# EAGLE design T-Board-44-84 Etch - v0.1 (EAGLE 6.5.0)
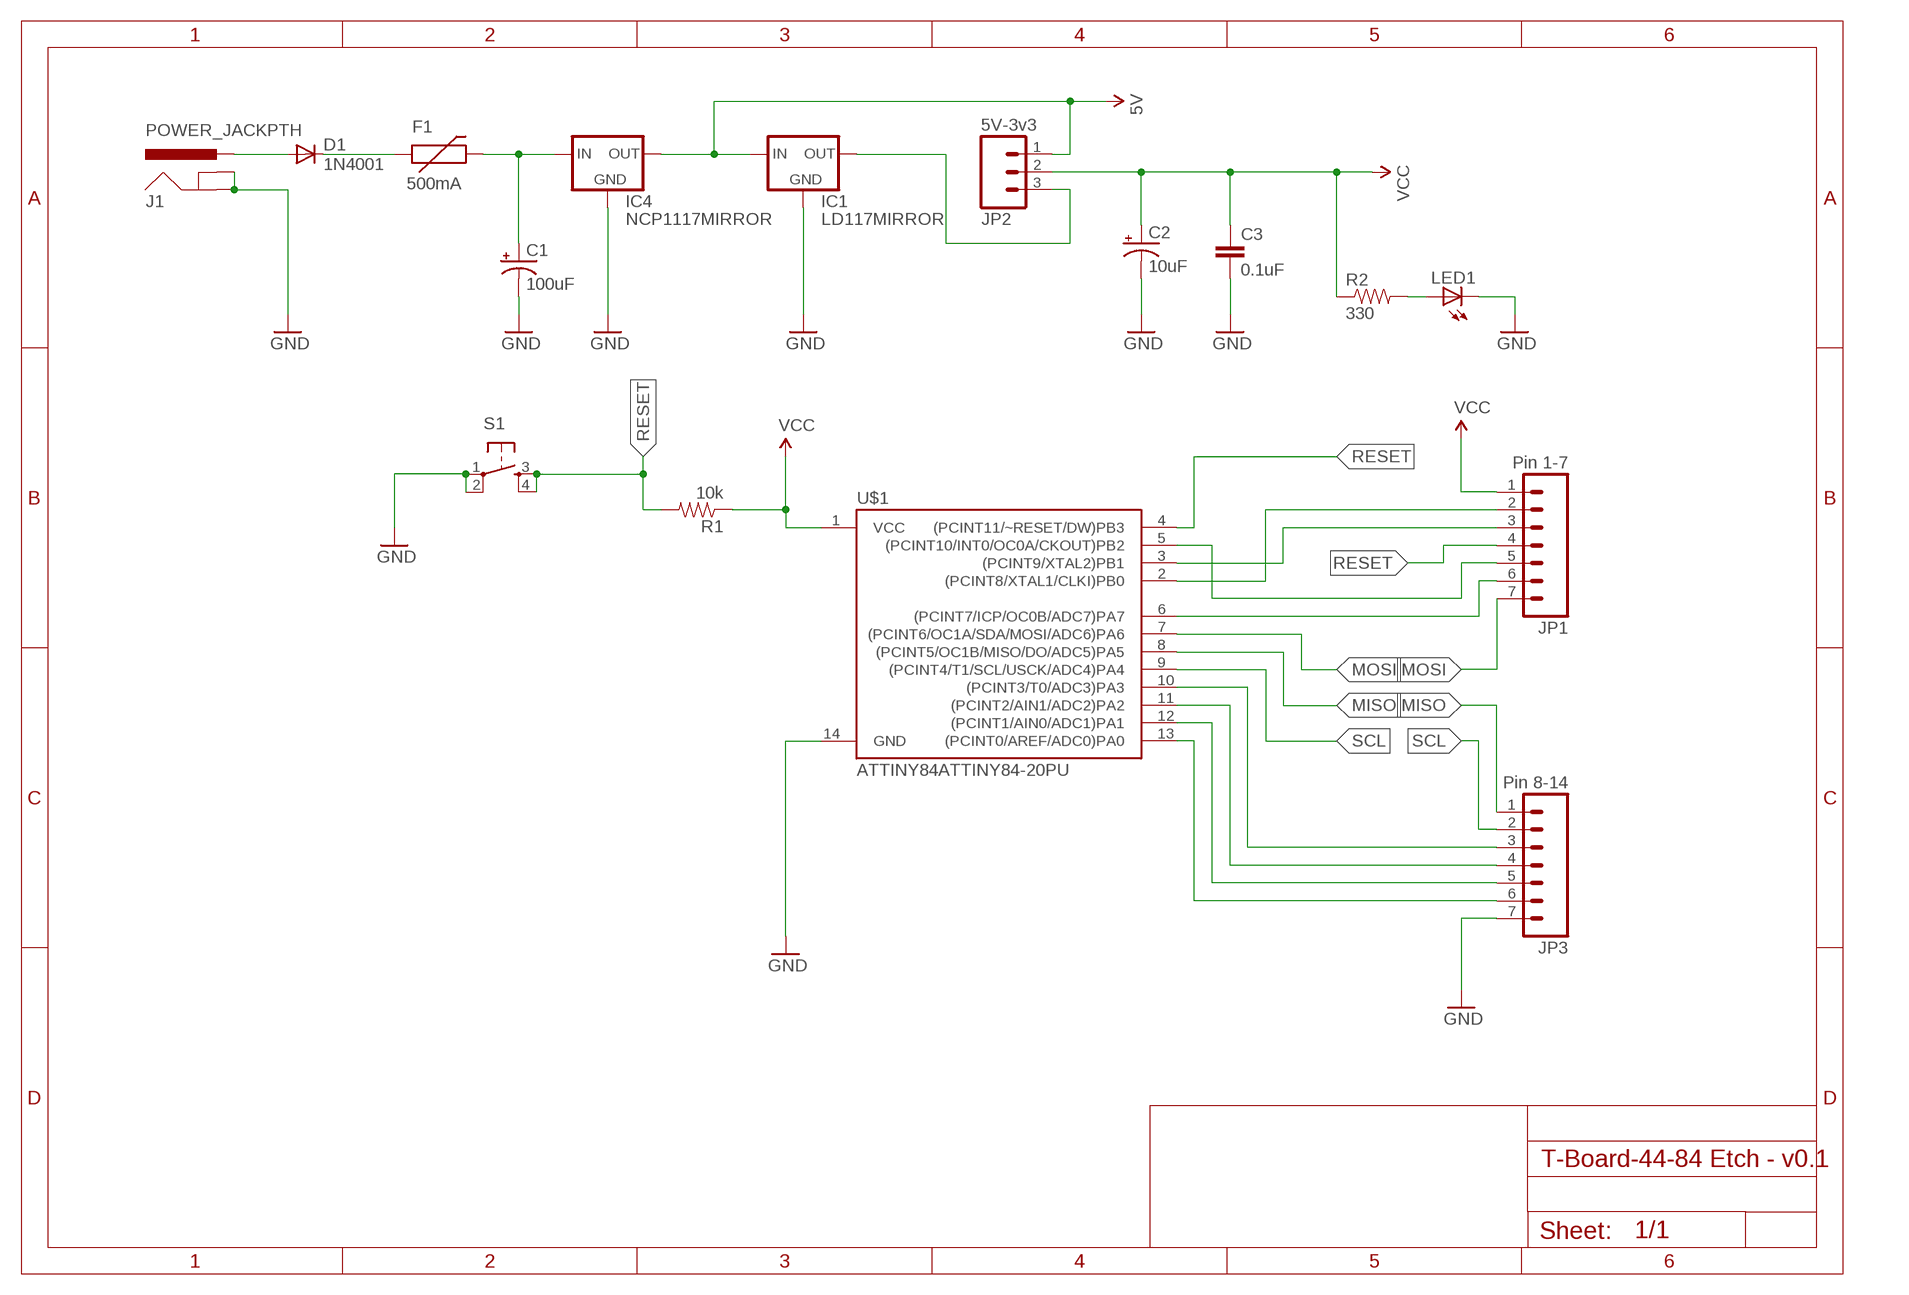
[diagram p0: schematic, sheet 1]

## Parts
C1  100uF  CAP_POLPTH1  [CPOL-RADIAL-100UF-25V]
C2  10uF  CAP_POLPTH2  [CPOL-RADIAL-10UF-25V]
C3  0.1uF  CAP1206  [1206]
D1  1N4001  DIODEPTH  [DIODE-1N4001]
F1  500mA  PTCPTH  [PTC]
IC1  LD117MIRROR  [SOT223]
IC4  NCP1117MIRROR  [DPACK]
J1  POWER_JACKPTH  [POWER_JACK_PTH]
JP1  Pin 1-7  M07  [1X07]
JP2  5V-3v3  M03PTH  [1X03]
JP3  Pin 8-14  M07  [1X07]
LED1  LED1206  [LED-1206]
R1  10k  RESISTOR1206  [1206]
R2  330  RESISTOR1206  [1206]
S1  TAC_SWITCHPTH  [TACTILE-PTH]
U$1  ATTINY84ATTINY84-20PU  [DIL14]

## Nets
5V: IC1.1(IN) IC4.4(OUT) JP2.1
GND: C1.2(-) C2.2(-) C3.2 IC1.3(GND) IC4.3(GND) J1.GND J1.GNDBREAK JP3.7 LED1.C S1.1 S1.2 U$1.14(GND)
MISO: JP3.1 U$1.8((PCINT5/OC1B/MISO/DO/ADC5)PA5)
MOSI: JP1.7 U$1.7((PCINT6/OC1A/SDA/MOSI/ADC6)PA6)
N$1: D1.A J1.PWR
N$2: JP1.2 U$1.2((PCINT8/XTAL1/CLKI)PB0)
N$3: D1.C F1.P$1
N$4: C1.1(+) F1.P$2 IC4.1(IN)
N$5: JP1.3 U$1.3((PCINT9/XTAL2)PB1)
N$6: JP3.3 U$1.10((PCINT3/T0/ADC3)PA3)
N$7: JP1.6 U$1.6((PCINT7/ICP/OC0B/ADC7)PA7)
N$8: JP3.4 U$1.11((PCINT2/AIN1/ADC2)PA2)
N$9: LED1.A R2.2
N$10: IC1.4(OUT) JP2.3
N$11: JP3.5 U$1.12((PCINT1/AIN0/ADC1)PA1)
N$12: JP3.6 U$1.13((PCINT0/AREF/ADC0)PA0)
N$14: JP1.5 U$1.5((PCINT10/INT0/OC0A/CKOUT)PB2)
RESET: JP1.4 R1.2 S1.3 S1.4 U$1.4((PCINT11/~RESET/DW)PB3)
SCL: JP3.2 U$1.9((PCINT4/T1/SCL/USCK/ADC4)PA4)
VCC: C2.1(+) C3.1 JP1.1 JP2.2 R1.1 R2.1 U$1.1(VCC)

## Library data of the parts
C1 C2 = SparkFun-Capacitors:CAP_POL: Capacitor Polarized These are standard SMD and PTH capacitors. Normally 10uF, 47uF, and 100uF in electrolytic and tantalum varieties. Always verify the external diameter of the through hole cap, it varies with capacity, voltage, and manufacturer. The EIA devices should be standard.
C3 = SparkFun-Passives:CAP: Capacitor Standard 0603 ceramic capacitor, and 0.1" leaded capacitor.
D1 = SparkFun-DiscreteSemi:DIODE: Diode These are standard reverse protection diodes and small signal diodes. SMA package can handle up to about 1A. SOD-323 can handle about 200mA. What the SOD-323 package when ordering, there are some mfgs out there that are 5-pin packages.
F1 = SparkFun-PowerIC:PTC: Resettable Fuse PTC Resettable Fuse. Spark Fun Electronics SKU : COM-08357
IC1 = AndyTallack:LD117: Low drop fixed and adjustable positive voltage regulators 1 A Source: http://www.st.com/stonline/products/literature/ds/7194/ld1117axx.pdf
IC4 = AndyTallack:NCP1117: NCP1117 ON Semiconductor low dropout fixed voltage regulator
J1 = SparkFun-Connectors:POWER_JACK: Power Jack This is the standard 5.5mm barrel jack for power. The PTH is the most common, proven, reliable, footprint. The Slot footprint only works if the mill layer is transmitted to the PCB fab house so be warned. Mating wall wart : TOL-00298 (and others); PROD_ID: PRT-00119
JP1 JP3 = SparkFun-Connectors:M07: Header 7 Standard 7-pin 0.1" header. Use with straight break away headers (SKU : PRT-00116), right angle break away headers (PRT-00553), swiss pins (PRT-00743), machine pins (PRT-00117), and female headers (PRT-00115). NOTES ON THE VARIANTS LOCK and LOCK_LONGPADS... This footprint was designed to help hold the alignment of a through-hole component (i.e. 7-pin header) while soldering it into place. You may notice that each hole has been shifted either up or down by 0.005 of an inch from it's more standard position (which is usually a perfectly straight line). This slight alteration caused the pins (the squares in the middle) to touch the edges of the holes. Because they are alternating, it causes a "brace" to hold the header in place. 0.005 has proven to be the perfect amount of "off-center" position when using our standard breakaway headers. Although looks a little odd when you look at the bare footprint, once you have a header in there, the alteration is very hard to notice. Also, if you push a header all the way into place, it is covered up entirely on the bottom side. This idea of altering the position of holes to aid alignment will be further integrated into the Sparkfun Library for other footprints. It can help hold any component with 3 or more connection pins.
JP2 = SparkFun-Connectors:M03: Header 3 Standard 3-pin 0.1" header. Use with straight break away headers (SKU : PRT-00116), right angle break away headers (PRT-00553), swiss pins (PRT-00743), machine pins (PRT-00117), and female headers (PRT-00115). Molex polarized connector foot print use with SKU : PRT-08232 with associated crimp pins and housings.
LED1 = SparkFun-LED:LED: LEDs Standard schematic elements and footprints for 5mm, 3mm, 1206, and 0603 sized LEDs. 5mm - Spark Fun Electronics SKU : COM-00529 (and others)
R1 R2 = SparkFun-Passives:RESISTOR: Resistor Basic schematic elements and footprints for 0603, 1206, and PTH resistors.
S1 = SparkFun-Electromechanical:TAC_SWITCH: Momentary Switch Button commonly used for reset or general input. Spark Fun Electronics SKU : COM-00097 SMT- SWCH-08247
U$1 = SparkFun-DigitalIC:ATTINY84: Atmel 14-pin 2/4/8kB flash uC

## Net classes
0 default: width 0.254 mm, drill 0.33 mm, clearance 0.254 mm

## Board
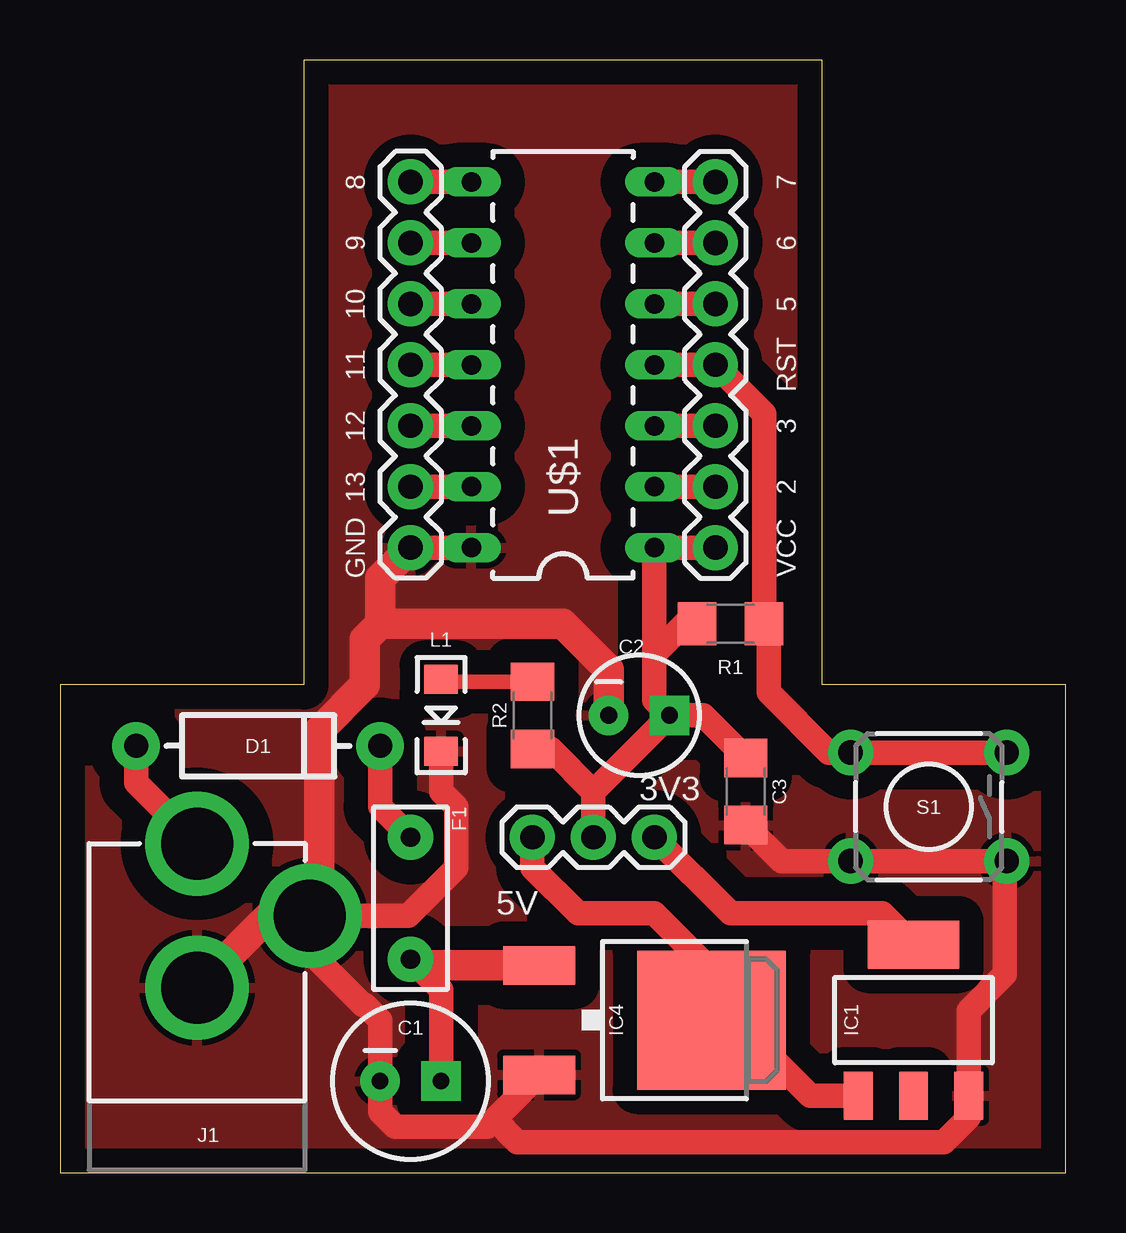
[diagram p1: board, top side]

Size 41.91 x 46.35 mm. Coordinates in mm from the lower left corner, seen from the top.
Outline: 0,0 41.91,0 41.91,20.32 31.75,20.32 31.75,46.35 10.16,46.35 10.16,20.32 0,20.32 0,0
Copper layers (1*16): Top 0.0356mm / dielectric 1.5011mm / Bottom 0.0356mm
Design rules "LaenPCBOrder": minimum track width 6mil, minimum drill 13mil, track to track 6mil, track to pad 6mil, pad to pad 6mil, via to via 6mil, smd to smd 6mil, copper to edge 15mil, drill to drill 6mil, minimum pad ring 7mil, minimum via ring 7mil, stop-mask expansion 3mil, vias tented up to drill 0mil, thermal gap 10mil

### Footprints (pad centres in the part's own frame; a part is rotated, then mirrored left to right if it is on the bottom)
CPOL-RADIAL-100UF-25V = drill 0.7 pad 1.651 square: 1 1.27,0 | drill 0.7 pad 1.651: 2 -1.27,0
CPOL-RADIAL-10UF-25V = drill 0.7 pad 1.651 square: 1 1.27,0 | drill 0.7 pad 1.651: 2 -1.27,0
1206 = smd 1.6 x 1.8: 1 -1.4,0; 2 1.4,0
DIODE-1N4001 = drill 1 pad 1.981: A -5.08,0; C 5.08,0
PTC = drill 0.8 pad 1.88: P$1 -2.54,0; P$2 2.54,0
SOT223 = smd 1.2 x 2: 1 -2.3,-3.15; 2 0,-3.15; 3 2.3,-3.15 | smd 3.8 x 2: 4 0,3.15
DPACK = smd 1.6 x 3: 1 -2.28,-4.8; 3 2.28,-4.8 | smd 5.8 x 6.2: 4 0,2.38
POWER_JACK_PTH = drill 2.997 pad 4.318: GND 0,7.7; GNDBREAK 4.7,10.7; PWR 0,13.7
1X07 = drill 1.016 pad 1.88: 1 0,0; 2 2.54,0; 3 5.08,0; 4 7.62,0; 5 10.16,0; 6 12.7,0; 7 15.24,0
1X03 = drill 1.016 pad 1.88: 1 0,0; 2 2.54,0; 3 5.08,0
LED-1206 = smd 1.2 x 1.4: A -1.5,0; C 1.5,0
TACTILE-PTH = drill 1.016 pad 1.88: 1 -3.251,2.261; 2 3.251,2.261; 3 -3.251,-2.261; 4 3.251,-2.261
DIL14 = drill 0.813 long: 1 -8.89,-3.81; 2 -6.35,-3.81; 3 -3.81,-3.81; 4 -1.27,-3.81; 5 1.27,-3.81; 6 3.81,-3.81; 7 6.35,-3.81; 8 6.35,3.81; 9 3.81,3.81; 10 1.27,3.81; 11 -1.27,3.81; 12 -3.81,3.81; 13 -6.35,3.81; 14 -8.89,3.81

### Placement (x,y rotation side)
C1  14.61,3.81 0 top
C2  24.13,19.05 0 top
C3  28.57,15.88 270 top
D1  8.26,17.78 0 top
F1  14.61,11.43 270 top
IC1  35.56,6.35 0 top
IC4  24.77,6.35 270 top
J1  5.71,0 0 top
JP1  27.3,26.04 90 top
JP2  19.68,13.97 0 top
JP3  14.61,41.27 270 top
LED1  15.88,19.05 270 top
R1  27.94,22.86 0 top
R2  19.68,19.05 90 top
S1  36.2,15.24 180 top
U$1  20.95,34.92 90 top

### Tracks (layer width: path | path; a pad name or v marks a point on that pad's centre or on a via)
5V
  Top 1.016: IC4.4 27.94,6.51 | JP2.1 19.68,12.7 21.59,10.79 24.77,10.79 27.94,7.62 27.94,6.51 | 27.94,6.51 31.25,3.2 IC1.1
GND
  Top 1.016: 18.11,2.21 17.8,1.91 13.97,1.91 13.34,2.54 C1.2 13.34,6.35 12.7,6.99 12.61,6.99 8.89,10.7 | 18.11,2.21 IC4.3 | J1.GNDBREAK 14.51,10.7 16.51,12.7 16.51,15.24 15.88,15.88 LED1.C | C3.2 30.07,12.98 S1.2 S1.1 39.37,12.9 39.37,8.26 37.86,6.75 IC1.3 37.86,2.3 36.83,1.27 19.05,1.27 18.11,2.21 | JP3.7 U$1.14
  Top 1.27: J1.GND 8.71,10.7 8.89,10.7 | 8.89,10.7 J1.GNDBREAK | C2.2 22.86,20.95 20.95,22.86 13.34,22.86 | 13.34,22.86 12.7,22.23 12.7,20.32 10.79,18.41 10.79,12.61 8.89,10.7 | 13.34,22.86 13.34,24.77 JP3.7
  pour Top (isolate 1.016): 10.16,46.35 10.16,20.32 0,20.32 0,0 41.91,0 41.91,20.32 31.75,20.32 31.75,46.35
MISO
  Top 1.016: JP3.1 U$1.8
MOSI
  Top 1.016: JP1.7 U$1.7
N$1
  Top 1.016: J1.PWR 3.17,16.24 D1.A
N$2
  Top 1.016: JP1.2 U$1.2
N$3
  Top 1.016: D1.C 13.34,15.24 F1.P$1
N$4
  Top 1.016: C1.1 15.88,7.62 F1.P$2 14.87,8.63
  Top 1.27: 14.87,8.63 IC4.1
N$5
  Top 1.016: JP1.3 U$1.3
N$6
  Top 1.016: JP3.3 U$1.10
N$7
  Top 1.016: JP1.6 U$1.6
N$8
  Top 1.016: JP3.4 U$1.11
N$9
  Top 0.61: LED1.A 15.97,20.45 R2.2
N$10
  Top 1.016: JP2.3 27.94,10.79 34.27,10.79 IC1.4
N$11
  Top 1.016: JP3.5 U$1.12
N$12
  Top 1.016: JP3.6 U$1.13
N$14
  Top 1.016: JP1.5 U$1.5
RESET
  Top 1.016: S1.3 S1.4 32.03,17.5 29.53,20 29.53,22.67 R1.2 29.34,31.62 JP1.4 U$1.4
SCL
  Top 1.016: JP3.2 U$1.9
VCC
  Top 0.61: R2.1 20.45,17.65
  Top 1.016: JP2.2 22.23,15.88 | 22.23,15.88 C2.1 | 20.45,17.65 22.23,15.88 | C3.1 26.8,19.05 C2.1 | 24.77,21.59 U$1.1 JP1.1 | 24.77,21.59 24.77,19.68 C2.1 | R1.1 26.04,22.86 24.77,21.59

### Text on the board
tNames: 8 | 7 | 9 | 6 | 10 | 5 | 11 | RST | 12 | 3 | 13 | 2 | GND | VCC | L1 | 3V3 | S1 | 5V